# EAGLE schematic Spring2020V1.2 (EAGLE 9.5.1)
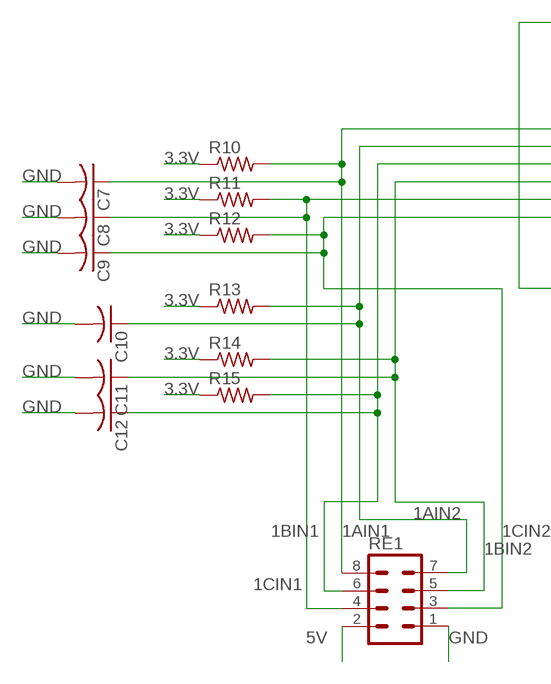
[diagram p0: schematic, sheet 1, part 1 of 2]
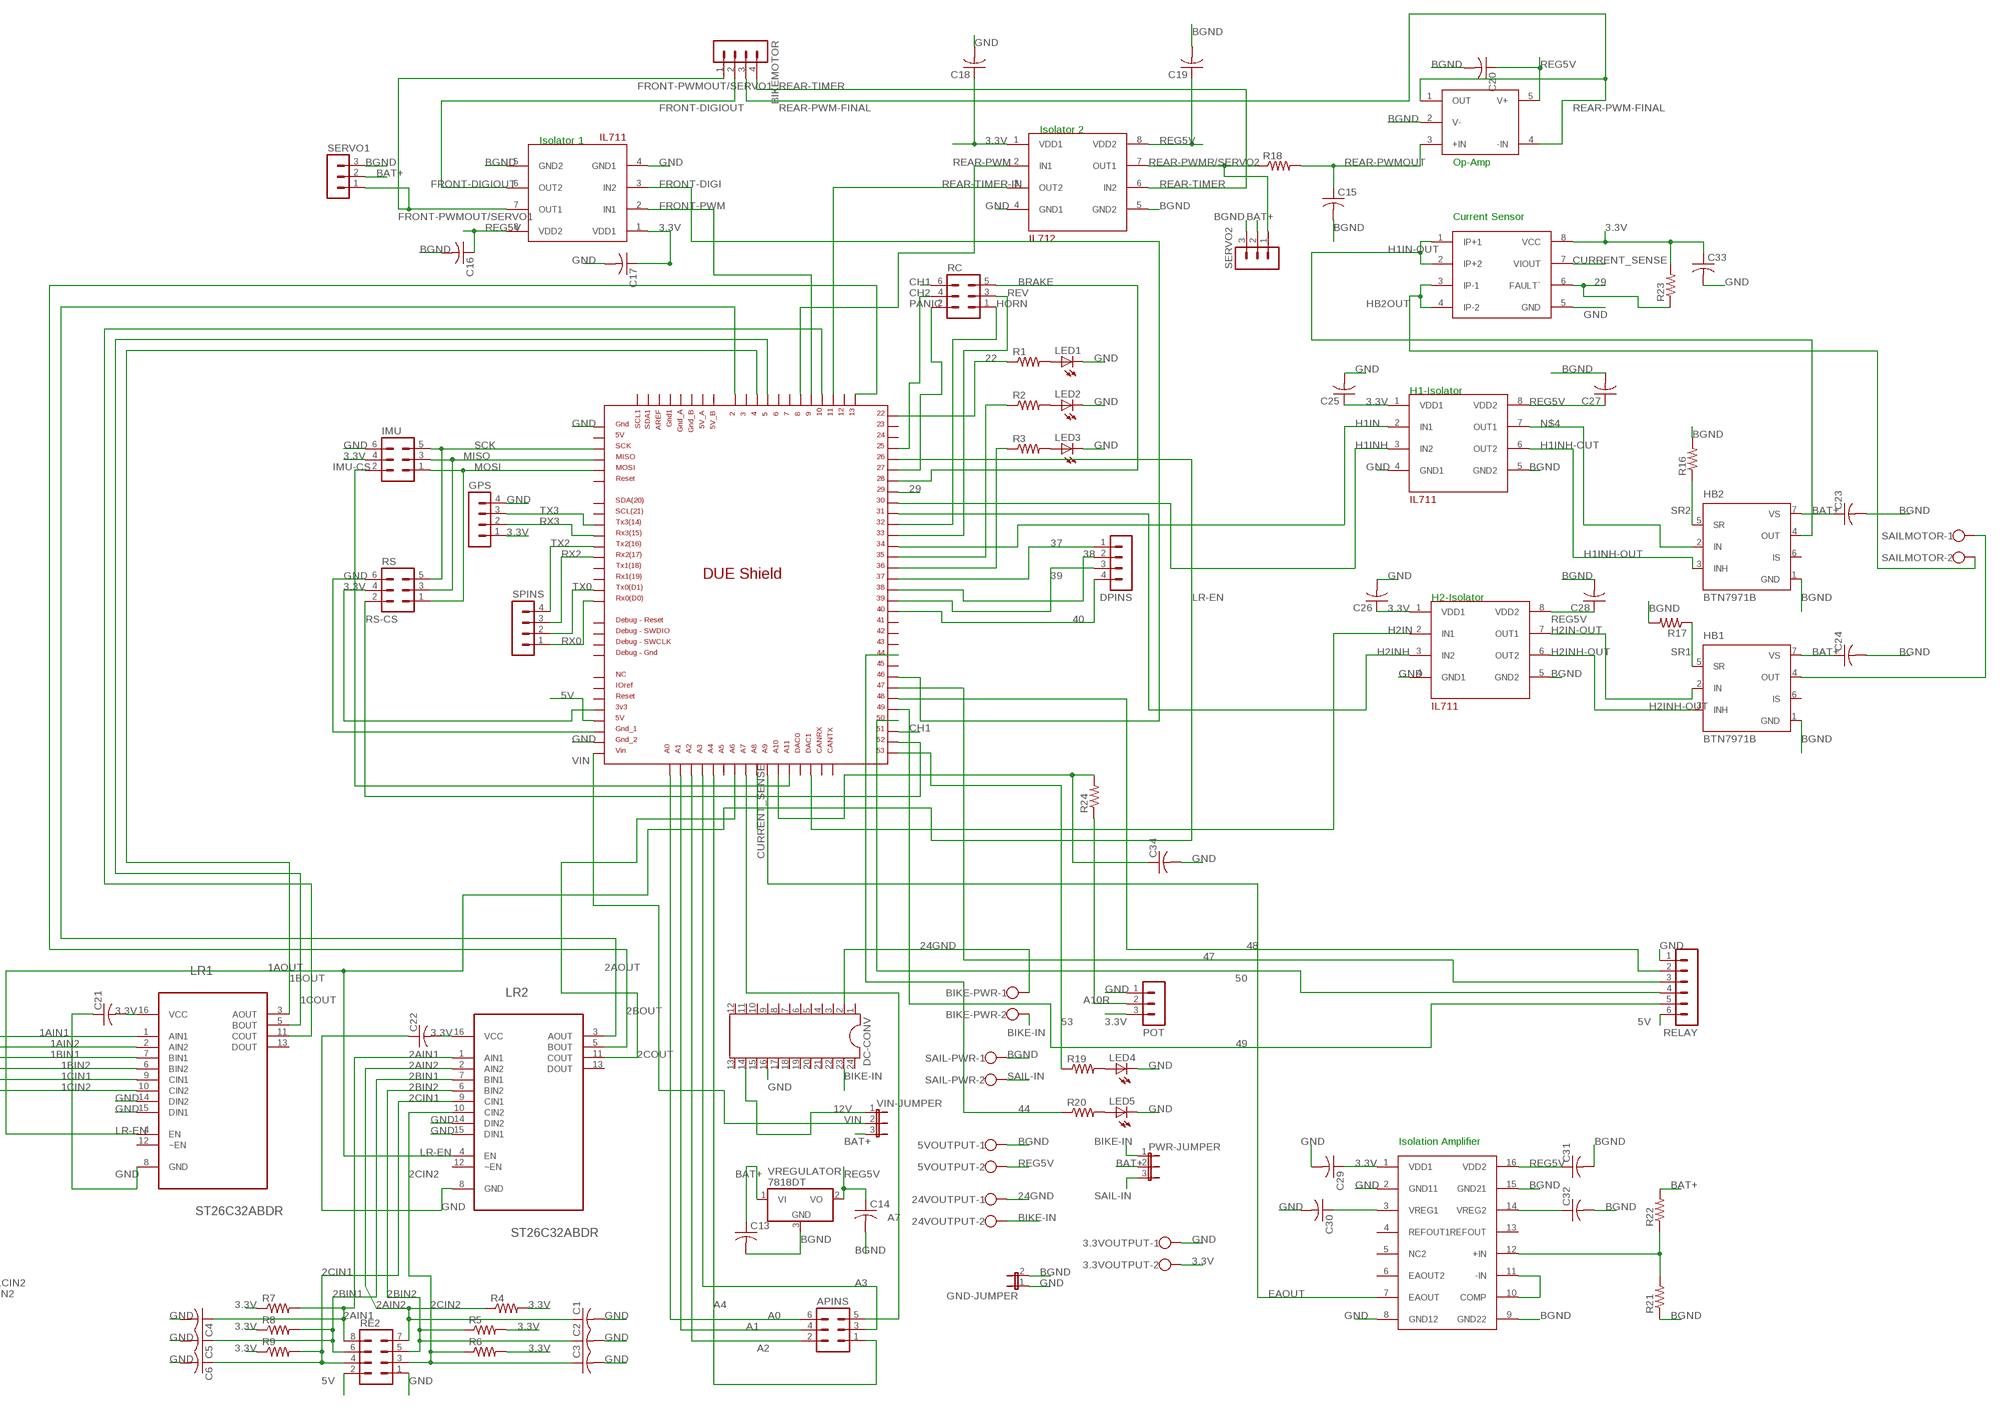
[diagram p1: schematic, sheet 1, part 2 of 2]

## Parts
3.3VOUTPUT  W237-102  [W237-102]
5VOUTPUT  W237-102  [W237-102]
24VOUTPUT  W237-102  [W237-102]
APINS  MA03-2  [MA03-2]
BIKE-PWR  W237-102  [W237-102]
BIKEMOTOR  MA04-1  [MA04-1]
C1  C-US025-025X050  [C025-025X050]
C2  C-US025-025X050  [C025-025X050]
C3  C-US025-025X050  [C025-025X050]
C4  C-US025-025X050  [C025-025X050]
C5  C-US025-025X050  [C025-025X050]
C6  C-US025-025X050  [C025-025X050]
C7  C-US025-025X050  [C025-025X050]
C8  C-US025-025X050  [C025-025X050]
C9  C-US025-025X050  [C025-025X050]
C10  C-US025-025X050  [C025-025X050]
C11  C-US025-025X050  [C025-025X050]
C12  C-US025-025X050  [C025-025X050]
C13  C-US025-050X050  [C025-050X050]
C14  C-US025-050X050  [C025-050X050]
C15  C-US025-050X050  [C025-050X050]
C16  C-US025-050X050  [C025-050X050]
C17  C-US025-050X050  [C025-050X050]
C18  C-US025-050X050  [C025-050X050]
C19  C-US025-050X050  [C025-050X050]
C20  C-US025-050X050  [C025-050X050]
C21  C-US025-050X050  [C025-050X050]
C22  C-US025-050X050  [C025-050X050]
C23  C-US150-091X182  [C150-091X182]
C24  C-US150-091X182  [C150-091X182]
C25  C-US025-050X050  [C025-050X050]
C26  C-US025-050X050  [C025-050X050]
C27  C-US025-050X050  [C025-050X050]
C28  C-US025-050X050  [C025-050X050]
C29  C-US025-050X050  [C025-050X050]
C30  C-US025-050X050  [C025-050X050]
C31  C-US025-050X050  [C025-050X050]
C32  C-US025-050X050  [C025-050X050]
C33  C-US025-050X050  [C025-050X050]
C34  C-US025-050X050  [C025-050X050]
DC-CONV  CU.INC---VAWQ6-Q48-S12H-6  [DIL24-6]
DPINS  MA04-1  [MA04-1]
GND-JUMPER  JP1E  [JP1]
GPS  MA04-1  [MA04-1]
HB1  BTN7971B  [P-TO263-7-1]
HB2  BTN7971B  [P-TO263-7-1]
IMU  MA03-2  [MA03-2]
LED1  LED5MM  [LED5MM]
LED2  LED5MM  [LED5MM]
LED3  LED5MM  [LED5MM]
LED4  LED5MM  [LED5MM]
LED5  LED5MM  [LED5MM]
LR1  ST26C32ABDR  [SOIC127P600X175-16N]
LR2  ST26C32ABDR  [SOIC127P600X175-16N]
OP-AMP  OPAMP  [SOT95P280X145-5N]
POT  MA03-1  [MA03-1]
PWR-JUMPER  JP2E  [JP2]
R1  R-US_0309/10  [0309/10]
R2  R-US_0309/10  [0309/10]
R3  R-US_0309/10  [0309/10]
R4  R-US_0613/15  [P0613/15]
R5  R-US_0613/15  [P0613/15]
R6  R-US_0613/15  [P0613/15]
R7  R-US_0613/15  [P0613/15]
R8  R-US_0613/15  [P0613/15]
R9  R-US_0613/15  [P0613/15]
R10  R-US_0613/15  [P0613/15]
R11  R-US_0613/15  [P0613/15]
R12  R-US_0613/15  [P0613/15]
R13  R-US_0613/15  [P0613/15]
R14  R-US_0613/15  [P0613/15]
R15  R-US_0613/15  [P0613/15]
R16  R-US_0613/15  [P0613/15]
R17  R-US_0613/15  [P0613/15]
R18  R-US_0414/15  [0414/15]
R19  R-US_0309/10  [0309/10]
R20  R-US_0309/10  [0309/10]
R21  R-US_0414/15  [0414/15]
R22  R-US_0414/15  [0414/15]
R23  R-US_0414/15  [0414/15]
R24  R-US_0414/15  [0414/15]
RC  MA03-2  [MA03-2]
RE1  MA04-2  [MA04-2]
RE2  MA04-2  [MA04-2]
RELAY  MA06-1  [MA06-1]
RS  MA03-2  [MA03-2]
SAIL-PWR  W237-102  [W237-102]
SAILMOTOR  W237-102  [W237-102]
SERVO1  MA03-1  [MA03-1]
SERVO2  MA03-1  [MA03-1]
SPINS  MA04-1  [MA04-1]
U$1  DUE(NORMAL)  [DUE(NORMAL)]
U$2  IL-711  [8PINSOIC]
U$3  IL-711  [8PINSOIC]
U$5  ISOLATED_ERROR_AMP_ADUM3190  [QSOP16]
U$6  IL-711  [8PINSOIC]
U$7  IL-712  [8PINSOIC]
U$8  LINEAR_CURRENT_SENSOR_ACS711  [SO8]
VIN-JUMPER  JP2E  [JP2]
VREGULATOR  7818DT  [TO252]

## Nets
1AIN1: C7.1 LR1.1(AIN1) R10.2 RE1.8
1AIN2: C10.1 LR1.2(AIN2) R13.2 RE1.7
1AOUT: LR1.3(AOUT) U$1.4
1BIN1: C12.1 LR1.7(BIN1) R15.2 RE1.6
1BIN2: C11.1 LR1.6(BIN2) R14.2 RE1.5
1BOUT: LR1.5(BOUT) U$1.5
1CIN1: C8.1 LR1.9(CIN1) R11.2 RE1.4
1CIN2: C9.1 LR1.10(CIN2) R12.2 RE1.3
1COUT: LR1.11(COUT) U$1.10
2AIN1: C4.1 LR2.1(AIN1) R7.2 RE2.8
2AIN2: C1.1 LR2.2(AIN2) R4.1 RE2.7
2AOUT: LR2.3(AOUT) U$1.2
2BIN1: C5.1 LR2.7(BIN1) R8.2 RE2.6
2BIN2: C2.1 LR2.6(BIN2) R5.1 RE2.5
2BOUT: LR2.5(BOUT) U$1.13
2CIN1: C6.1 LR2.9(CIN1) R9.2 RE2.4
2CIN2: C3.1 LR2.10(CIN2) R6.1 RE2.3
2COUT: LR2.11(COUT) U$1.A6
3.3V: 3.3VOUTPUT.2 C17.1 C18.1 C21.2 C22.2 C25.1 C26.1 C29.1 C33.1 GPS.1 IMU.4 LR1.16(VCC) LR2.16(VCC) POT.3 R4.2 R5.2 R6.2 R7.1 R8.1 R9.1 R10.1 R11.1 R12.1 R13.1 R14.1 R15.1 R23.2 RS.4 U$1.3V3 U$2.1(VDD1) U$3.1(VDD1) U$5.1(VDD1) U$6.1(VDD1) U$7.1(VDD1) U$8.8(VCC)
5V: RE1.2 RE2.2 RELAY.6 U$1.5V
12V: DC-CONV.14 VIN-JUMPER.1
22: R1.1 U$1.22
24GND: 24VOUTPUT.1 BIKE-PWR.1 DC-CONV.2
29: R23.1 U$1.29 U$8.6(FAULT`)
35: R2.1 U$1.35
36: R3.1 U$1.36
37: DPINS.1 U$1.37
38: DPINS.2 U$1.38
39: DPINS.3 U$1.39
40: DPINS.4 U$1.40
44: R20.1 U$1.44
47: RELAY.3 U$1.47
48: RELAY.2 U$1.48
49: RELAY.5 U$1.49
50: RELAY.4 U$1.50
53: R19.1 U$1.53
A0: APINS.6 U$1.A0
A1: APINS.4 U$1.A1
A2: APINS.2 U$1.A2
A3: APINS.3 U$1.A3
A4: APINS.1 U$1.A4
A7: APINS.5 U$1.A7
A10: C34.1 R24.2 U$1.A10
A10R: POT.2 R24.1
BAT+: C13.1 C23.1 C24.1 HB1.7(VS) HB2.7(VS) PWR-JUMPER.2 R22.2 SERVO1.2 SERVO2.2 VIN-JUMPER.3 VREGULATOR.1(VI)
BGND: 5VOUTPUT.1 C13.2 C14.2 C15.2 C16.2 C19.2 C20.2 C23.2 C24.2 C27.2 C28.2 C31.2 C32.2 GND-JUMPER.2 HB1.1(GND) HB2.1(GND) OP-AMP.2(V-) R16.2 R17.2 R21.1 SAIL-PWR.1 SERVO1.3 SERVO2.3 U$2.5(GND2) U$3.5(GND2) U$5.9(GND22) U$5.15(GND21) U$6.5(GND2) U$7.5(GND2) VREGULATOR.3(GND)
BIKE-IN: 24VOUTPUT.2 BIKE-PWR.2 DC-CONV.23 PWR-JUMPER.1
BRAKE: RC.5 U$1.28
CH1: RC.6 U$1.51
CH2: RC.4 U$1.25
CURRENT_SENSE: U$1.A8 U$8.7(VIOUT)
EAOUT: U$1.A9 U$5.7(EAOUT)
FRONT-DIGI: U$1.46 U$2.3(IN2)
FRONT-DIGIOUT: BIKEMOTOR.2 U$2.6(OUT2)
FRONT-PWM: U$1.9 U$2.2(IN1)
FRONT-PWMOUT/SERVO1: BIKEMOTOR.1 SERVO1.1 U$2.7(OUT1)
GND: 3.3VOUTPUT.1 C1.2 C2.2 C3.2 C4.2 C5.2 C6.2 C7.2 C8.2 C9.2 C10.2 C11.2 C12.2 C17.2 C18.2 C21.1 C22.1 C25.2 C26.2 C29.2 C30.2 C33.2 C34.2 DC-CONV.16 GND-JUMPER.1 GPS.4 IMU.6 LED1.K(C) LED2.K(C) LED3.K(C) LED4.K(C) LED5.K(C) LR1.8(GND) LR1.14(DIN2) LR1.15(DIN1) LR2.8(GND) LR2.14(DIN2) LR2.15(DIN1) POT.1 RE1.1 RE2.1 RELAY.1 RS.6 U$1.5V_ICSP U$1.GND_1 U$1.GND_2 U$2.4(GND1) U$3.4(GND1) U$5.2(GND11) U$5.8(GND12) U$6.4(GND1) U$7.4(GND1) U$8.5(GND)
H1IN: U$1.34 U$3.2(IN1)
H1IN-OUT: HB2.4(OUT) U$8.1(IP+1) U$8.2(IP+2)
H1INH: U$1.30 U$3.3(IN2)
H1INH-OUT: HB2.3(INH) U$3.6(OUT2)
H2IN: U$1.DAC1 U$6.2(IN1)
H2IN-OUT: HB1.2(IN) U$6.7(OUT1)
H2INH: U$1.31 U$6.3(IN2)
H2INH-OUT: HB1.3(INH) U$6.6(OUT2)
HB1OUT: HB1.4(OUT) SAILMOTOR.1
HB2OUT: SAILMOTOR.2 U$8.3(IP-1) U$8.4(IP-2)
HORN: RC.1 U$1.32
IMU-CS: IMU.2 U$1.A11
LR-EN: LR1.4(EN) LR2.4(EN) U$1.26
MISO: IMU.3 RS.3 U$1.MISO_ICSP
MOSI: IMU.1 RS.1 U$1.MOSI_ICSP
N$1: LED1.A R1.2
N$2: LED2.A R2.2
N$3: LED3.A R3.2
N$4: HB2.2(IN) U$3.7(OUT1)
N$6: LED4.A R19.2
N$7: C32.1 U$5.14(VREG2)
N$8: LED5.A R20.2
N$9: U$5.10(COMP) U$5.11(-IN)
N$10: R21.2 R22.1 U$5.12(+IN)
N$11: C30.1 U$5.3(VREG1)
PANIC: RC.2 U$1.27
REAR-PWM: U$1.8 U$7.2(IN1)
REAR-PWM-FINAL: BIKEMOTOR.3 OP-AMP.1(OUT) OP-AMP.4(-IN)
REAR-PWMOUT: C15.1 OP-AMP.3(+IN) R18.2
REAR-PWMR/SERVO2: R18.1 SERVO2.1 U$7.7(OUT1)
REAR-TIMER: BIKEMOTOR.4 U$7.6(IN2)
REAR-TIMER-IN: U$1.11 U$7.3(OUT2)
REG5V: 5VOUTPUT.2 C14.1 C16.1 C19.1 C20.1 C27.1 C28.1 C31.1 OP-AMP.5(V+) U$2.8(VDD2) U$3.8(VDD2) U$5.16(VDD2) U$6.8(VDD2) U$7.8(VDD2) VREGULATOR.2(VO)
REV: RC.3 U$1.33
RS-CS: RS.2 U$1.52
RX0: SPINS.1 U$1.RX0
RX2: SPINS.3 U$1.RX2
RX3: GPS.2 U$1.RX3
SAIL-IN: PWR-JUMPER.3 SAIL-PWR.2
SCK: IMU.5 RS.5 U$1.SCK_ICSP
SR1: HB1.5(SR) R17.1
SR2: HB2.5(SR) R16.1
TX0: SPINS.2 U$1.TX0
TX2: SPINS.4 U$1.TX2
TX3: GPS.3 U$1.TX3
VIN: U$1.VIN VIN-JUMPER.2
Unconnected: DC-CONV.1 DC-CONV.3 DC-CONV.4 DC-CONV.5 DC-CONV.6 DC-CONV.7 DC-CONV.8 DC-CONV.9 DC-CONV.10 DC-CONV.11 DC-CONV.12 DC-CONV.13 DC-CONV.15 DC-CONV.17 DC-CONV.18 DC-CONV.19 DC-CONV.20 DC-CONV.21 DC-CONV.22 DC-CONV.24 HB1.6(IS) HB2.6(IS) LR1.12(~EN) LR1.13(DOUT) LR2.12(~EN) LR2.13(DOUT) U$1.3 U$1.5V_A U$1.5V_B U$1.6 U$1.7 U$1.12 U$1.23 U$1.24 U$1.41 U$1.42 U$1.43 U$1.45 U$1.A5 U$1.AREF U$1.CANRX U$1.CANTX U$1.DAC0 U$1.GND1 U$1.GND_A U$1.GND_B U$1.GND_DEBUG U$1.GND_ICSP U$1.IOREF U$1.NC U$1.RESET U$1.RESET_DEBUG U$1.RESET_ICSP U$1.RX1 U$1.SCL U$1.SCL1 U$1.SDA U$1.SDA1 U$1.SWCLK_DEBUG U$1.SWDIO_DEBUG U$1.TX1 U$5.4(REFOUT1) U$5.5(NC2) U$5.6(EAOUT2) U$5.13(REFOUT)

## Notes on the sheet
- Isolator 2
- Isolator 1
- Op-Amp
- Current Sensor
- H1-Isolator
- H2-Isolator
- Isolation Amplifier

## Library data of the parts
3.3VOUTPUT 5VOUTPUT 24VOUTPUT BIKE-PWR SAIL-PWR SAILMOTOR = con-wago-500:W237-102: WAGO SCREW CLAMP; MPN: 237-102; OC_FARNELL: unknown; OC_NEWARK: 70K9898
APINS IMU RC RS = con-lstb:MA03-2: PIN HEADER
BIKEMOTOR DPINS GPS SPINS = con-lstb:MA04-1: PIN HEADER
C1-C34 = resistor:C-US: CAPACITOR, American symbol
DC-CONV = Spring2016DC_DC_Conv:CU.INC---VAWQ6-Q48-S12H: Dual In Line
GND-JUMPER = jumper:JP1E: JUMPER
HB1 HB2 = Spring2016HBridgelbr:BTN7971B
LED1-LED5 = led:LED: LED OSRAM: - CHIPLED LG R971, LG N971, LY N971, LG Q971, LY Q971, LO R971, LY R971 LH N974, LH R974 LS Q976, LO Q976, LY Q976 LO Q996 - Hyper CHIPLED LW Q18S LB Q993, LB Q99A, LB R99A - SideLED LS A670, LO A670, LY A670, LG A670, LP A670 LB A673, LV A673, LT A673, LW A673 LH A674 LY A675 LS A676, LA A676, LO A676, LY A676, LW A676 LS A679, LY A679, LG A679 - Hyper Micro SIDELED® LS Y876, LA Y876, LO Y876, LY Y876 LT Y87S - SmartLED LW L88C, LW L88S LB L89C, LB L89S, LG L890 LS L89K, LO L89K, LY L89K LS L896, LA L896, LO L896, LY L896 - TOPLED LS T670, LO T670, LY T670, LG T670, LP T670 LSG T670, LSP T670, LSY T670, LOP T670, LYG T670 LG T671, LOG T671, LSG T671 LB T673, LV T673, LT T673, LW T673 LH T674 LS T676, LA T676, LO T676, LY T676, LB T676, LH T676, LSB T676, LW T676 LB T67C, LV T67C, LT T67C, LS T67K, LO T67K, LY T67K, LW E67C LS E67B, LA E67B, LO E67B, LY E67B, LB E67C, LV E67C, LT E67C LW T67C LS T679, LY T679, LG T679 LS T770, LO T770, LY T770, LG T770, LP T770 LB T773, LV T773, LT T773, LW T773 LH T774 LS E675, LA E675, LY E675, LS T675 LS T776, LA T776, LO T776, LY T776, LB T776 LHGB T686 LT T68C, LB T68C - Hyper Mini TOPLED® LB M676 - Mini TOPLED Santana® LG M470 LS M47K, LO M47K, LY M47K Source: http://www.osram.convergy.de LUXEON: - LUMILED® LXK2-PW12-R00, LXK2-PW12-S00, LXK2-PW14-U00, LXK2-PW14-V00 LXK2-PM12-R00, LXK2-PM12-S00, LXK2-PM14-U00 LXK2-PE12-Q00, LXK2-PE12-R00, LXK2-PE12-S00, LXK2-PE14-T00, LXK2-PE14-U00 LXK2-PB12-K00, LXK2-PB12-L00, LXK2-PB12-M00, LXK2-PB14-N00, LXK2-PB14-P00, LXK2-PB14-Q00 LXK2-PR12-L00, LXK2-PR12-M00, LXK2-PR14-Q00, LXK2-PR14-R00 LXK2-PD12-Q00, LXK2-PD12-R00, LXK2-PD12-S00 LXK2-PH12-R00, LXK2-PH12-S00 LXK2-PL12-P00, LXK2-PL12-Q00, LXK2-PL12-R00 Source: www.luxeon.com KINGBRIGHT: KA-3528ASYC Source: www.kingbright.com
LR1 LR2 = BikeTeamLR:ST26C32ABDR: CMOS quad 3-state differential line receiver; MPN: ST26C32ABDR; OC_FARNELL: -; OC_NEWARK: 89K0998; PACKAGE: SOIC-16; SUPPLIER: STMICROELECTRONICS
OP-AMP = Spring2016opamp:OPAMP
POT SERVO1 SERVO2 = con-lstb:MA03-1: PIN HEADER
PWR-JUMPER VIN-JUMPER = jumper:JP2E: JUMPER
R1-R3 R19 R20 = rcl:R-US_: RESISTOR, American symbol
R4-R18 R21-R24 = resistor:R-US_: RESISTOR, American symbol
RE1 RE2 = con-lstb:MA04-2: PIN HEADER
RELAY = con-lstb:MA06-1: PIN HEADER
U$1 = DUElib130425:DUE(NORMAL)
U$2 U$3 U$6 = Spring2016Optoisolator:IL-711
U$5 = Spring2016IsolatedErrorAmp:ISOLATED_ERROR_AMP_ADUM3190
U$7 = Spring2016Optoisolator:IL-712
U$8 = Spring2016linearCurretnSensor:LINEAR_CURRENT_SENSOR_ACS711
VREGULATOR = linear:78*: Positive VOLTAGE REGULATOR Source: http://cache.national.com/ds/LM/LM78L05.pdf http://www.fairchildsemi.com/ds/LM/LM7805.pdf